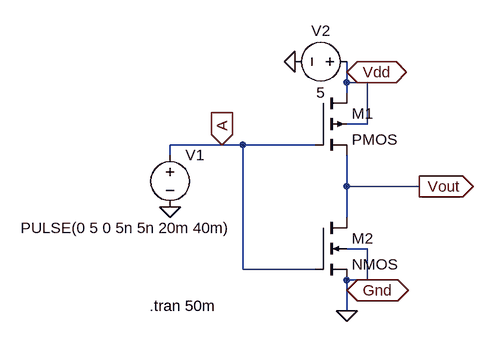
[diagram p0: schematic Inverter.asc]
Inverter.asc, the LTspice schematic file:
Version 4.1
SHEET 1 880 680
WIRE 224 64 224 48
WIRE 224 80 224 64
WIRE 256 80 224 80
WIRE 224 96 224 80
WIRE 256 144 256 80
WIRE 256 144 224 144
WIRE 32 176 -48 176
WIRE 64 176 32 176
WIRE 176 176 64 176
WIRE -48 192 -48 176
WIRE 224 240 224 192
WIRE 336 240 224 240
WIRE 224 288 224 240
WIRE 256 336 224 336
WIRE 64 368 64 176
WIRE 176 368 64 368
WIRE 256 384 256 336
WIRE 256 384 224 384
WIRE 224 400 224 384
WIRE 224 432 224 400
FLAG -48 272 0
FLAG 144 48 0
FLAG 224 432 0
FLAG 32 176 A
IOPIN 32 176 In
FLAG 336 240 Vout
IOPIN 336 240 Out
FLAG 224 64 Vdd
IOPIN 224 64 BiDir
FLAG 224 400 Gnd
IOPIN 224 400 BiDir
SYMBOL pmos4 176 96 R0
SYMATTR InstName M1
SYMBOL nmos4 176 288 R0
SYMATTR InstName M2
SYMBOL voltage -48 176 R0
WINDOW 3 -230 128 Left 2
WINDOW 123 0 0 Left 0
WINDOW 39 0 0 Left 0
SYMATTR InstName V1
SYMATTR Value PULSE(0 5 0 5n 5n 20m 40m)
SYMBOL voltage 240 48 R90
WINDOW 0 -32 56 VBottom 2
WINDOW 3 32 56 VTop 2
WINDOW 123 0 0 Left 0
WINDOW 39 0 0 Left 0
SYMATTR InstName V2
SYMATTR Value 5
TEXT -80 424 Left 2 !.tran 50m

The netlist it stands for:
* Inverter.asc
M1 Vdd A Vout Vdd PMOS
M2 Vout A 0 0 NMOS
V1 A 0 PULSE(0 5 0 5n 5n 20m 40m)
V2 Vdd 0 5
.model NMOS NMOS
.model PMOS PMOS
.lib standard.mos
.tran 50m
.backanno
.end